# EAGLE design MAPE-CUN-Large-032 (EAGLE 7.3.0)
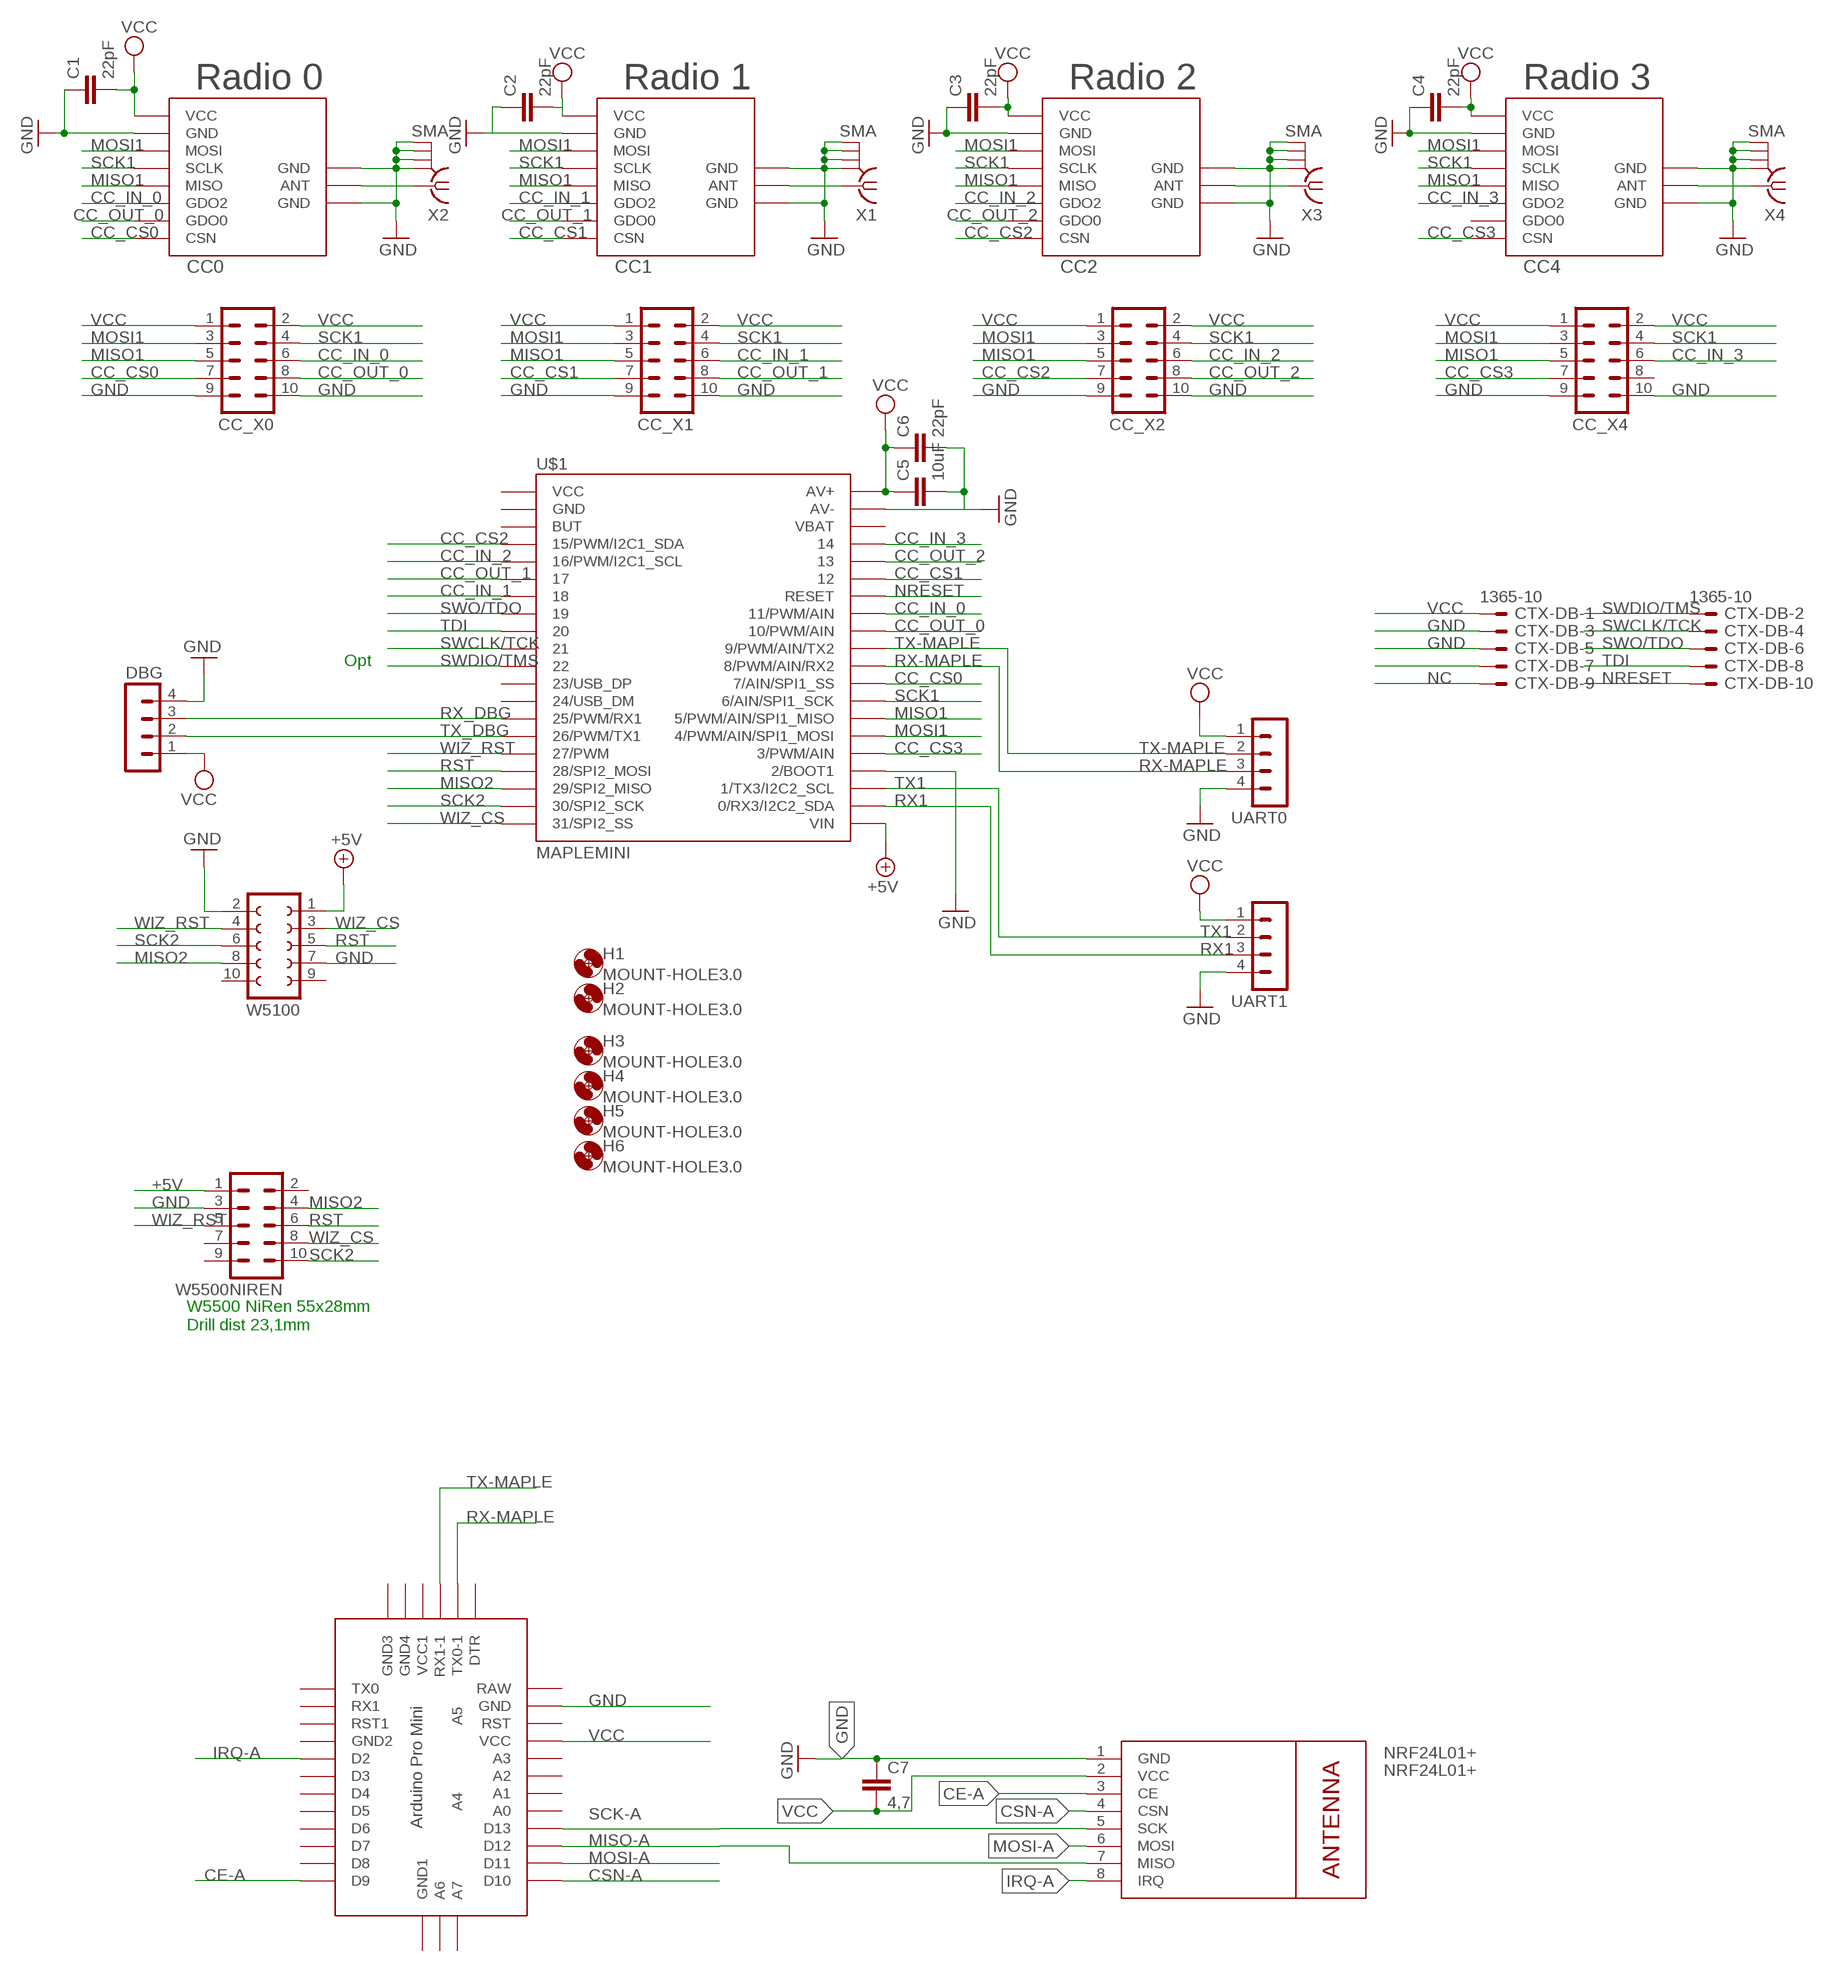
[diagram p0: schematic, sheet 1]

## Parts
C1  22pF  C-EUC0805  [C0805]
C2  22pF  C-EUC0805  [C0805]
C3  22pF  C-EUC0805  [C0805]
C4  22pF  C-EUC0805  [C0805]
C5  10uF  C-EUC1210  [C1210]
C6  22pF  C-EUC0805  [C0805]
C7  4,7  C-EUC1210  [C1210]
CC0  CC1101_MODULE1SMD  [CC1101_MODULE1_SMD]
CC1  CC1101_MODULE1SMD  [CC1101_MODULE1_SMD]
CC2  CC1101_MODULE1SMD  [CC1101_MODULE1_SMD]
CC4  CC1101_MODULE1SMD  [CC1101_MODULE1_SMD]
CC_X0  MA05-2  [MA05-2]
CC_X1  MA05-2  [MA05-2]
CC_X2  MA05-2  [MA05-2]
CC_X4  MA05-2  [MA05-2]
CTX-DB  1365-10  [1365-10]
DBG  MA04-1  [MA04-1]
H1  MOUNT-HOLE3.0  [3,0]
H2  MOUNT-HOLE3.0  [3,0]
H3  MOUNT-HOLE3.0  [3,0]
H4  MOUNT-HOLE3.0  [3,0]
H5  MOUNT-HOLE3.0  [3,0]
H6  MOUNT-HOLE3.0  [3,0]
NRF24L01+  NRF24L01+  WIRELESS-NRF24L01  [WIRELESS-NRF24L01]
U$1  MAPLEMINI  [20-DIP]
U$2  ABK-PRO-MINI  [ABK-PRO-MINI]
UART0  MA04-1  [MA04-1]
UART1  MA04-1  [MA04-1]
W5100  FE05-2  [FE05-2]
W5500NIREN  MA05-2  [MA05-2]
X1  SMA  [SMA]
X2  SMA  [SMA]
X3  SMA  [SMA]
X4  SMA  [SMA]

## Nets
+5V: U$1.21(VIN) W5100.1 W5500NIREN.1
CC_CS0: CC0.CSN CC_X0.7 U$1.29(7/AIN/SPI1_SS)
CC_CS1: CC1.CSN CC_X1.7 U$1.35
CC_CS2: CC2.CSN CC_X2.7 U$1.4(15/PWM/I2C1_SDA)
CC_CS3: CC4.CSN CC_X4.7 U$1.25(3/PWM/AIN)
CC_IN_0: CC0.GDO2 CC_X0.6 U$1.33(11/PWM/AIN)
CC_IN_1: CC1.GDO2 CC_X1.6 U$1.7
CC_IN_2: CC2.GDO2 CC_X2.6 U$1.5(16/PWM/I2C1_SCL)
CC_IN_3: CC4.GDO2 CC_X4.6 U$1.37
CC_OUT_0: CC0.GDO0 CC_X0.8 U$1.32(10/PWM/AIN)
CC_OUT_1: CC1.GDO0 CC_X1.8 U$1.6
CC_OUT_2: CC2.GDO0 CC_X2.8 U$1.36
CE-A: NRF24L01+.3(CE) U$2.D9
CSN-A: NRF24L01+.4(CSN) U$2.D10
GND: C1.1 C2.1 C3.1 C4.1 C5.2 C6.2 C7.1 CC0.GND@0(GND) CC0.GND@1(GND) CC0.GND@2(GND) CC1.GND@0(GND) CC1.GND@1(GND) CC1.GND@2(GND) CC2.GND@0(GND) CC2.GND@1(GND) CC2.GND@2(GND) CC4.GND@0(GND) CC4.GND@1(GND) CC4.GND@2(GND) CC_X0.9 CC_X0.10 CC_X1.9 CC_X1.10 CC_X2.9 CC_X2.10 CC_X4.9 CC_X4.10 CTX-DB.3 CTX-DB.5 DBG.4 NRF24L01+.1(GND) U$1.24(2/BOOT1) U$1.39(AV-) U$2.GND UART0.4 UART1.4 W5100.2 W5100.7 W5500NIREN.3 X1.GND@1 X1.GND@2 X1.GND@3 X1.GND@4 X2.GND@1 X2.GND@2 X2.GND@3 X2.GND@4 X3.GND@1 X3.GND@2 X3.GND@3 X3.GND@4 X4.GND@1 X4.GND@2 X4.GND@3 X4.GND@4
IRQ-A: NRF24L01+.8(IRQ) U$2.D2
MISO1: CC0.MISO CC1.MISO CC2.MISO CC4.MISO CC_X0.5 CC_X1.5 CC_X2.5 CC_X4.5 U$1.27(5/PWM/AIN/SPI1_MISO)
MISO2: U$1.18(29/SPI2_MISO) W5100.8 W5500NIREN.4
MISO-A: NRF24L01+.7(MISO) U$2.D12
MOSI1: CC0.MOSI CC1.MOSI CC2.MOSI CC4.MOSI CC_X0.3 CC_X1.3 CC_X2.3 CC_X4.3 U$1.26(4/PWM/AIN/SPI1_MOSI)
MOSI-A: NRF24L01+.6(MOSI) U$2.D11
N$1: CC2.ANT X3.1
N$2: CC4.ANT X4.1
N$3: CC1.ANT X1.1
N$4: CC0.ANT X2.1
N$8: CTX-DB.7
NC: CTX-DB.9
NRESET: CTX-DB.10 U$1.34(RESET)
RST: U$1.17(28/SPI2_MOSI) W5100.5 W5500NIREN.6
RX1: U$1.22(0/RX3/I2C2_SDA) UART1.3
RX-MAPLE: U$1.30(8/PWM/AIN/RX2) U$2.TX0-1 UART0.3
RX_DBG: DBG.3 U$1.14(25/PWM/RX1)
SCK1: CC0.SCLK CC1.SCLK CC2.SCLK CC4.SCLK CC_X0.4 CC_X1.4 CC_X2.4 CC_X4.4 U$1.28(6/AIN/SPI1_SCK)
SCK2: U$1.19(30/SPI2_SCK) W5100.6 W5500NIREN.10
SCK-A: NRF24L01+.5(SCK) U$2.D13
SWCLK/TCK: CTX-DB.4 U$1.10
SWDIO/TMS: CTX-DB.2 U$1.11
SWO/TDO: CTX-DB.6 U$1.8
TDI: CTX-DB.8 U$1.9
TX1: U$1.23(1/TX3/I2C2_SCL) UART1.2
TX-MAPLE: U$1.31(9/PWM/AIN/TX2) U$2.RX1-1 UART0.2
TX_DBG: DBG.2 U$1.15(26/PWM/TX1)
VCC: C1.2 C2.2 C3.2 C4.2 C5.1 C6.1 C7.2 CC0.VCC CC1.VCC CC2.VCC CC4.VCC CC_X0.1 CC_X0.2 CC_X1.1 CC_X1.2 CC_X2.1 CC_X2.2 CC_X4.1 CC_X4.2 CTX-DB.1 DBG.1 NRF24L01+.2(VCC) U$1.40(AV+) U$2.VCC UART0.1 UART1.1
WIZ_CS: U$1.20(31/SPI2_SS) W5100.3 W5500NIREN.8
WIZ_RST: U$1.16(27/PWM) W5100.4 W5500NIREN.5
Unconnected: CC4.GDO0 CC_X4.8 U$1.1(VCC) U$1.2(GND) U$1.3(BUT) U$1.12(23/USB_DP) U$1.13(24/USB_DM) U$1.38(VBAT) U$2.A0 U$2.A1 U$2.A2 U$2.A3 U$2.A4 U$2.A5 U$2.A6 U$2.A7 U$2.D3 U$2.D4 U$2.D5 U$2.D6 U$2.D7 U$2.D8 U$2.DTR U$2.GND1(GND2) U$2.GND2(GND3) U$2.GND3(GND4) U$2.GND4(GND1) U$2.RAW U$2.RST U$2.RST1 U$2.RX1 U$2.TX0 U$2.VCC1 W5100.9 W5100.10 W5500NIREN.2 W5500NIREN.7 W5500NIREN.9

## Notes on the sheet
- Radio 0 | Radio 1 | Radio 2 | Radio 3
- Opt
- W5500 NiRen 55x28mm
  Drill dist 23,1mm

## Library data of the parts
C1-C7 = rcl:C-EU: CAPACITOR, European symbol
CC0 CC1 CC2 CC4 = wireless:CC1101_MODULE1: CC1101 wireless module for 433/868 MHz (sold from Aliexpress). DIL version for mounting with pin header (and SMD soldering) and SMD only variant available.
CC_X0 CC_X1 CC_X2 CC_X4 W5500NIREN = con-lstb:MA05-2: PIN HEADER; OC_FARNELL: unknown; OC_NEWARK: unknown
CTX-DB = con-leotronics:1365-10: DUAL ROW STRAIGHT HEADER 1364 SERIES. 1.27mm x 1.27mm. Without Fixing Post. SMT Source: http://www.leotronics.co.uk/Conexcon/Data%20Sheets/sec.%20A/1364ing.pdf; OC_FARNELL: unknown; OC_NEWARK: unknown
DBG UART0 UART1 = con-lstb:MA04-1: PIN HEADER; OC_FARNELL: unknown; OC_NEWARK: unknown
H1-H6 = holes:MOUNT-HOLE: MOUNTING HOLE with drill center marker
NRF24L01+ = diy-modules:WIRELESS-NRF24L01: 2.4 GHz Wireless Module based on NRF24L01 chip
U$1 = maplemini-small:MAPLEMINI
U$2 = Arduino-clone:ABK-PRO-MINI: ABK Pro-Mini Arduino Clone
W5100 = con-lsta:FE05-2: FEMALE HEADER; OC_FARNELL: unknown; OC_NEWARK: unknown
X1-X4 = sma:SMA: SMA 50 Ohm end launch jack receptacle - round contact

## Net classes
0 default: width 0.406 mm
1 PWR: width 0.305 mm

## Board
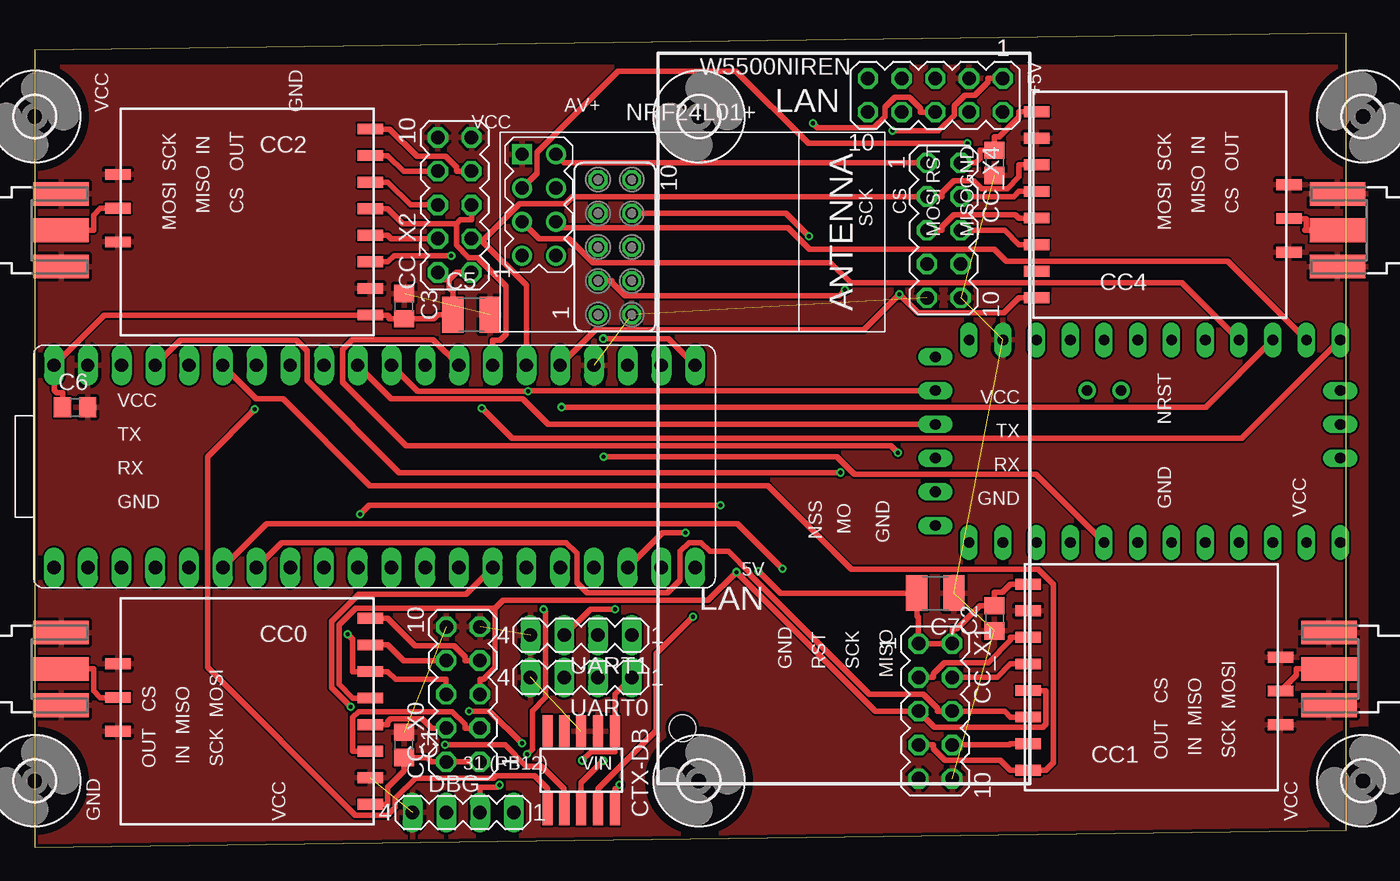
[diagram p1: board, top side]
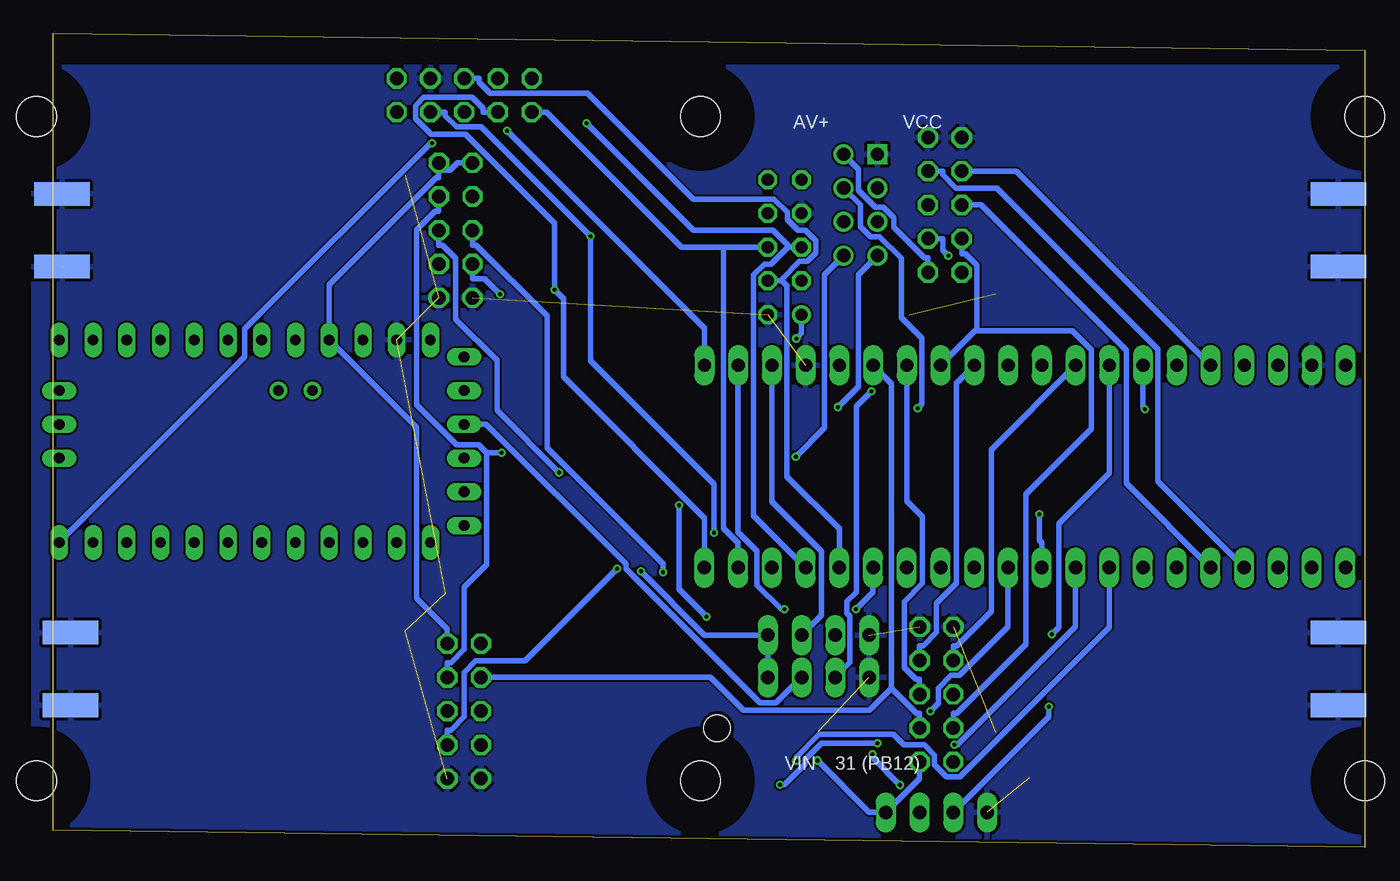
[diagram p2: board, bottom side, seen from below]

Size 98.73 x 61.27 mm. Coordinates in mm from the lower left corner, seen from the top.
Outline: 0,60 0,0 98.73,1.27 98.73,61.27 0,60
Copper layers (1*16): Top 0.035mm / dielectric 1.5mm / Bottom 0.035mm
Design rules "SeeedStudio_2layer_DRU_no_angle_20140221": minimum track width 6mil, minimum drill 12mil, track to track 6mil, track to pad 6mil, pad to pad 6mil, via to via 6mil, smd to smd 0mil, copper to edge 10mil, drill to drill 10mil, minimum pad ring 10mil, minimum via ring 6mil, stop-mask expansion 2mil, vias tented up to drill 100mil, thermal gap 10mil
Holes 2 mm at 48.76,8.97
tRestrict: area -0.1,59.1 to 100.2,59.8
bRestrict: area -0.1,59.1 to 100.2,59.8

### Footprints (pad centres in the part's own frame; a part is rotated, then mirrored left to right if it is on the bottom)
C0805 = smd 1.3 x 1.5: 1 -0.95,0; 2 0.95,0
C1210 = smd 1.6 x 2.7: 1 -1.4,0; 2 1.4,0
CC1101_MODULE1_SMD = smd 1.93 x 0.813: ANT 19,5.96; CSN 0,0; GDO0 0,2; GDO2 0,4; GND@0 0,12; GND@1 19,8.5; GND@2 19,3.42; MISO 0,6; MOSI 0,10; SCLK 0,8; VCC 0,14
MA05-2 = drill 1.016 octagon: 1 -5.08,-1.27; 2 -5.08,1.27; 3 -2.54,-1.27; 4 -2.54,1.27; 5 0,-1.27; 6 0,1.27; 7 2.54,-1.27; 8 2.54,1.27; 9 5.08,-1.27; 10 5.08,1.27
1365-10 = smd 0.76 x 2.4: 1 -2.54,-2.95; 2 -2.54,2.95; 3 -1.27,-2.95; 4 -1.27,2.95; 5 0,-2.95; 6 0,2.95; 7 1.27,-2.95; 8 1.27,2.95; 9 2.54,-2.95; 10 2.54,2.95
MA04-1 = drill 1.016 long: 1 -3.81,0; 2 -1.27,0; 3 1.27,0; 4 3.81,0
3,0 = hole 3: 0,0
WIRELESS-NRF24L01 = drill 1 square: 1 -12.7,6.35 | drill 1: 2 -10.16,6.35; 3 -12.7,3.81; 4 -10.16,3.81; 5 -12.7,1.27; 6 -10.16,1.27; 7 -12.7,-1.27; 8 -10.16,-1.27
20-DIP = drill 1.016 pad 1.27 long: 1 -24.13,-7.62; 2 -21.59,-7.62; 3 -19.05,-7.62; 4 -16.51,-7.62; 5 -13.97,-7.62; 6 -11.43,-7.62; 7 -8.89,-7.62; 8 -6.35,-7.62; 9 -3.81,-7.62; 10 -1.27,-7.62; 11 1.27,-7.62; 12 3.81,-7.62; 13 6.35,-7.62; 14 8.89,-7.62; 15 11.43,-7.62; 16 13.97,-7.62; 17 16.51,-7.62; 18 19.05,-7.62; 19 21.59,-7.62; 20 24.13,-7.62 | drill 1 pad 1.27 long: 21 24.13,7.62; 22 21.59,7.62; 23 19.05,7.62; 24 16.51,7.62; 25 13.97,7.62; 26 11.43,7.62; 27 8.89,7.62; 28 6.35,7.62; 29 3.81,7.62; 30 1.27,7.62; 31 -1.27,7.62; 32 -3.81,7.62; 33 -6.35,7.62; 34 -8.89,7.62; 35 -11.43,7.62; 36 -13.97,7.62; 37 -16.51,7.62; 38 -19.05,7.62; 39 -21.59,7.62; 40 -24.13,7.62
ABK-PRO-MINI = drill 0.8 long: A0 10.16,-3.81; A1 10.16,-6.35; A2 10.16,-8.89; A3 10.16,-11.43; A6 3.81,-21.59; A7 6.35,-21.59; D2 -5.08,-3.81; D3 -5.08,-6.35; D4 -5.08,-8.89; D5 -5.08,-11.43; D6 -5.08,-13.97; D7 -5.08,-16.51; D8 -5.08,-19.05; D9 -5.08,-21.59; D10 10.16,-21.59; D11 10.16,-19.05; D12 10.16,-16.51; D13 10.16,-13.97; DTR 8.89,8.89; GND 10.16,3.81; GND1 -5.08,-1.27; GND2 -3.81,8.89; GND3 -1.27,8.89; GND4 1.27,-21.59; RAW 10.16,6.35; RST 10.16,1.27; RST1 -5.08,1.27; RX1 -5.08,3.81; RX1-1 3.81,8.89; TX0 -5.08,6.35; TX0-1 6.35,8.89; VCC 10.16,-1.27; VCC1 1.27,8.89 | drill 0.8: A4 6.35,-5.08; A5 6.35,-2.54
FE05-2 = drill 0.914: 1 -5.08,1.27 | drill 0.914 octagon: 2 -5.08,-1.27; 3 -2.54,1.27; 4 -2.54,-1.27; 5 0,1.27; 6 0,-1.27; 7 2.54,1.27; 8 2.54,-1.27; 9 5.08,1.27; 10 5.08,-1.27
SMA = smd 4.191 x 1.778: 1 2.115,0; GND@1 2.115,2.733; GND@2 2.115,-2.733 | smd 4.191 x 1.778 bottom: GND@3 2.115,2.733; GND@4 2.115,-2.733

### Placement (x,y rotation side)
C1  27.8,7.71 270 top
C2  72.25,17.23 90 top
C3  27.8,40.73 270 top
C4  72.25,51.52 90 top
C5  32.88,40.09 0 top
C6  3.03,33.11 0 top
C7  67.8,19.13 180 top
CC0  25.26,17.23 180 top
CC1  74.79,5.8 0 top
CC2  25.26,54.06 180 top
CC4  75.42,41.36 0 top
CC_X0  32.24,11.51 90 top
CC_X1  67.8,10.24 270 top
CC_X2  31.61,48.35 90 top
CC_X4  68.44,46.44 270 top
CTX-DB  41.13,5.8 180 top
DBG  32.24,2.62 180 top
H1  100,5 0 top
H2  100,55 90 top
H3  0,5 0 top
H4  0,55 0 top
H5  50,5 0 top
H6  50,55 0 top
NRF24L01+  49.39,45.8 0 top
U$1  25.58,28.66 0 top
U$2  76.69,28.02 90 top
UART0  41.13,12.79 180 top
UART1  41.13,15.96 180 top
W5100  43.67,45.17 90 top
W5500NIREN  67.8,56.6 180 top
X1  99.55,13.42 180 top
X2  -0.14,13.42 0 top
X3  -0.14,46.44 0 top
X4  100.19,46.44 180 top

### Tracks (layer width: path | path; a pad name or v marks a point on that pad's centre or on a via)
+5V  (via drill 0.3 pad 0.61)
  Top 0.406: U$1.21 47.7,38.29 v42.8,38.29 | W5500NIREN.1 71.77,57.87 71.77,57.6 70.77,56.6 70.02,56.6 69.23,55.8 69.23,55.1 68.05,53.92 v64.58,53.92
  Bottom 0.406: v42.8,38.29 42.41,38.69 W5100.1 | U$1.21 49.71,39.05 v64.58,53.92
CC_CS0
  Top 0.406: CC0.CSN 26.58,17.23 28.64,15.17 31.56,15.17 32.4,14.33 32.4,14.05 CC_X0.7
  Bottom 0.406: CC_X0.7 33.52,15.17 33.24,15.17 32.24,16.17 32.24,18.37 30.76,19.86 30.76,34.91 U$1.29
CC_CS1
  Top 0.406: U$1.35 16.68,33.75 18.69,33.75 25.21,27.22 55.2,27.22 61.5,20.92 75.54,20.92 76.68,19.79 76.68,6.37 76.11,5.8 CC1.CSN 73.47,5.8 72.71,6.56 68.52,6.56 67.65,7.43 67.65,7.71 CC_X1.7
CC_CS2
  Top 0.406: CC_X2.7 31.76,50.89 31.76,51.17 30.92,52 28.79,52 26.73,54.06 CC2.CSN
  Bottom 0.406: U$1.4 15.58,27.55 15.58,37.5 27.7,49.62 30.77,49.62 31.76,50.61 31.76,50.89 CC_X2.7
CC_CS3  (via drill 0.3 pad 0.61)
  Top 0.406: U$1.25 42.22,38.95 62.42,38.95 v65.09,41.62 66.47,40.23 72.98,40.23 74.1,41.36 CC4.CSN
  Bottom 0.406: CC_X4.7 67.17,42.78 66.25,42.78 v65.09,41.62
CC_IN_0  (via drill 0.3 pad 0.61)
  Top 0.406: v23.57,16.05 23.94,15.67 23.94,13.23 CC0.GDO2 25.92,13.23 26.58,13.23 27.18,12.63 30.97,12.63 CC_X0.6
  Bottom 0.406: U$1.33 19.23,28.15 23.04,24.34 23.04,16.57 v23.57,16.05
CC_IN_1
  Top 0.406: 50.83,22.27 52.21,22.27 53.84,20.63 53.84,20.5 62.82,11.51 66.89,11.51 67.96,10.45 67.96,10.24 68.52,10.24 CC_X1.6 73.02,10.24 73.47,9.8 CC1.GDO2 | 50.83,22.27 | 50.83,22.27 50.17,22.92 49.24,22.92 48.59,22.27 48.59,20.11 47.62,19.14 41.58,19.14 40.82,19.9 40.82,22.12 40.01,22.93 18.57,22.93 U$1.7
CC_IN_2
  Top 0.406: CC2.GDO2 26.58,50.06 28.3,48.35 CC_X2.6
  Bottom 0.406: U$1.5 17.96,27.39 17.96,37.42 28.88,48.35 CC_X2.6
CC_IN_3  (via drill 0.3 pad 0.61)
  Top 0.406: U$1.37 10.94,38.15 19.73,38.15 20.5,37.38 20.5,35.14 27.43,28.21 v60.64,28.21 | CC4.GDO2 74.1,45.36 73.02,46.44 CC_X4.6
  Bottom 0.406: CC_X4.6 69.71,45.32 69.44,45.32 68.44,44.33 68.44,39.76 65.33,36.65 65.33,32.9 v60.64,28.21
CC_OUT_0
  Top 0.406: CC0.GDO0 26.58,15.23 27.76,14.05 CC_X0.8
  Bottom 0.406: U$1.32 28.12,29.93 28.12,17.76 30.7,15.17 30.97,15.17 CC_X0.8
CC_OUT_1  (via drill 0.3 pad 0.61)
  Top 0.406: U$1.6 17.44,24.34 52.91,24.34 v56.29,20.96 | CC1.GDO0 73.47,7.8 73.37,7.71 CC_X1.8
  Bottom 0.406: CC_X1.8 69.08,8.82 68.8,8.82 67.8,9.82 67.8,13.15 66.93,14.03 63.22,14.03 v56.29,20.96
CC_OUT_2
  Top 0.406: CC2.GDO0 26.58,52.06 27.76,50.89 CC_X2.8
  Bottom 0.406: U$1.36 26.21,50.89 CC_X2.8
CE-A  (via drill 0.3 pad 0.61)
  Top 0.406: v70.22,52.99 58.23,52.99 52.81,58.42 43.91,58.42 37.8,52.31 37.8,50.73 NRF24L01+.3
  Bottom 0.406: U$2.D9 84.31,36.92 84.31,39.02 70.34,52.99 v70.22,52.99
CSN-A  (via drill 0.3 pad 0.61)
  Top 0.406: U$2.D10 90.89,30.79 35.93,30.79 v33.66,33.06
  Bottom 0.406: NRF24L01+.4 37.96,48.35 37.96,46.72 37.2,45.97 36.53,45.97 34.89,44.33 34.89,39.84 33.35,38.3 33.35,33.37 v33.66,33.06
GND  (13 unrouted)
  pour Bottom: -0.14,59.78 -0.14,0.08 100.19,0.08 100.19,59.78
  pour Top: -0.14,0.08 -0.14,59.78 100.19,59.78 100.19,0.08
IRQ-A  (via drill 0.3 pad 0.61)
  Top 0.406: U$2.D2 75.38,28.07 61.71,28.07 60.39,29.39 v42.84,29.39
  Bottom 0.406: v42.84,29.39 40.66,31.57 40.66,43.11 NRF24L01+.8
MISO1  (via drill 0.3 pad 0.61)
  Top 0.406: 31.74,46.94 27.71,46.94 26.58,48.06 CC2.MISO | 31.74,46.94 32.03,47.23 32.88,47.23 CC_X2.5 | 31.74,46.94 31.74,45.3 32.66,44.38 33.34,44.38 35.48,42.24 35.48,38.61 35.02,38.14 34.47,38.14 U$1.27 | 34.66,17.99 35.24,18.58 50.69,18.58 v52.82,20.72 63.29,10.24 CC_X1.5 67.75,9.03 75.9,9.03 76.11,9.24 76.11,11.8 CC1.MISO | 34.66,17.99 24.15,17.99 22.91,16.75 22.91,12.26 23.94,11.23 CC0.MISO | 34.66,17.99 34.66,13.5 33.79,12.63 33.52,12.63 CC_X0.5 | CC4.MISO 74.1,47.36 73.84,47.62 69.19,47.62 68.29,46.72 68.29,46.44 CC_X4.5
  Bottom 0.406: CC_X0.5 33.52,12.63 33.79,12.63 34.67,13.51 34.67,18.48 33.3,19.86 33.3,24.87 34.47,26.04 U$1.27 | v52.82,20.72 52.82,21.33 61.56,30.06 61.56,39.99 66.89,45.32 67.17,45.32 CC_X4.5
MISO2  (via drill 0.3 pad 0.61)
  Top 0.406: W5100.8 46.01,47.71 56.56,47.71 v58.28,45.99 | v49,23.68 47.26,23.68 U$1.18
  Bottom 0.406: W5500NIREN.4 69.23,55.33 69.23,55.05 68.39,54.21 66.51,54.21 v58.28,45.99 58.28,36.62 49,27.34 v49,23.68
MISO-A  (via drill 0.3 pad 0.61)
  Top 0.406: U$2.D12 88.16,33.14 v39.66,33.14
  Bottom 0.406: v39.66,33.14 38.12,34.68 38.12,43.11 NRF24L01+.7
MOSI1  (via drill 0.3 pad 0.61)
  Top 0.406: CC2.MOSI 26.58,44.06 27.05,44.53 v31.36,44.53 | 33.67,45.62 36.5,48.45 39.95,48.45 40.48,48.98 66.05,48.98 CC_X4.3 68.29,48.98 68.29,49.25 69.2,50.17 70.67,50.17 71.28,49.56 73.22,49.56 74.1,50.45 74.1,51.36 CC4.MOSI | 33.67,45.62 33.49,45.8 CC_X2.3 | U$1.26 37.01,42.29 33.67,45.62 | CC0.MOSI 23.94,7.23 23.94,9.79 24.36,10.22 31.43,10.22 32.4,9.25 32.4,8.97 CC_X0.3 | CC1.MOSI 73.47,15.8 73.47,15.59 71.79,13.9 68.49,13.9 67.65,13.06 67.65,12.79 CC_X1.3
  Bottom 0.406: CC_X2.3 31.76,45.8 31.76,44.93 v31.36,44.53 | 35.62,11.97 33.74,10.09 33.52,10.09 CC_X0.3 | U$1.26 35.62,34.89 35.62,11.97 | 35.62,11.97 37.28,10.31 46.76,10.31 49.24,12.79 65.42,12.79 CC_X1.3
MOSI-A
  Top 0.406: NRF24L01+.6 39.69,46.62 56.72,46.62 58.32,45.02 72.24,45.02 73.13,44.12 89.81,44.12 U$2.D11
N$1
  Top 0.406: X3.1 4.43,46.44 4.43,47.59 4.94,48.1 CC2.ANT
N$2
  Top 0.406: CC4.ANT 95.75,47.32 95.75,46.56 95.62,46.44 X4.1
N$3
  Top 0.406: X1.1 94.99,13.42 94.99,12.96 CC1.ANT
N$4
  Top 0.406: CC0.ANT 4.94,11.27 4.43,11.78 4.43,13.42 X2.1
NRESET  (via drill 0.3 pad 0.61)
  Top 0.406: CTX-DB.10 38.59,4.41 37.62,5.38 34.73,5.38 34.55,5.2 28.65,5.2 27.14,3.69 27.14,3 26.56,2.42 24.13,2.42 13,13.54 13,29.4 v16.56,32.96
  Bottom 0.406: U$1.34 16.69,33.08 v16.56,32.96
RST  (via drill 0.3 pad 0.61)
  Top 0.406: W5500NIREN.6 66.69,55.33 66.69,55.61 65.85,56.45 64.76,56.45 64,55.69 64,55 63.15,54.15 58.93,54.15 v58.6,54.48
  Bottom 0.406: 43.29,45.17 43.42,45.17 44.69,43.9 45.19,43.9 46.01,43.07 46.01,24.96 U$1.17 | W5100.5 43.29,45.17 | v58.6,54.48 50.55,46.44 44.56,46.44 43.29,45.17
RX1  (via drill 0.3 pad 0.61)
  Top 0.406: UART1.3 41.83,17.92 v43.67,17.92
  Bottom 0.406: v43.67,17.92 43.92,17.92 45.74,19.74 45.74,22.29 47.17,23.71 U$1.22
RX-MAPLE  (via drill 0.3 pad 0.61)
  Top 0.406: U$1.30 28.82,34.31 v37.14,34.31 37.21,34.38 66.14,34.38 U$2.TX0-1
  Bottom 0.406: UART0.3 38.74,13.91 38.74,17.4 38.96,17.63 38.96,18.51 38.28,19.2 38.28,33.18 v37.14,34.31
RX_DBG  (via drill 0.3 pad 0.61)
  Top 0.406: U$1.14 32.48,19.05 24.38,19.05 22.35,17.02 22.35,12 v23.78,10.57
  Bottom 0.406: v23.78,10.57 23.78,9.82 DBG.3
SCK1  (via drill 0.3 pad 0.61)
  Top 0.406: v64.99,29.7 64.46,30.23 27.96,30.23 23.19,35 23.19,37.5 23.91,38.21 30,38.21 U$1.28 | CC_X4.4 73.72,48.98 74.1,49.36 CC4.SCLK | CC_X2.4 26.84,45.8 26.58,46.06 CC2.SCLK | CC0.SCLK 26.58,9.23 26.58,9.44 26.8,9.66 29.17,9.66 29.86,8.97 CC_X0.4 | CC1.SCLK 73.47,13.8 72.45,12.79 CC_X1.4
  Bottom 0.406: U$1.28 29.35,38.86 29.19,38.86 | 66.11,29.7 66.11,21.27 67.8,19.57 67.8,14.9 68.8,13.9 69.08,13.9 CC_X1.4 | 66.11,29.7 66.71,30.3 68.38,30.3 71.39,33.31 71.39,46.47 69.99,47.86 69.71,47.86 CC_X4.4 | v64.99,29.7 66.11,29.7 | 29.19,38.86 22.02,38.86 20.59,37.44 20.59,31.51 25.52,26.58 25.52,15.27 30.7,10.09 30.97,10.09 CC_X0.4 | 29.19,38.86 29.19,43.81 30.07,44.69 30.34,44.69 CC_X2.4
SCK2
  Bottom 0.406: W5500NIREN.10 61.61,55.33 51.45,45.17 48.28,45.17 | U$1.19 47.17,22.92 48.28,24.03 48.28,45.17 | 48.28,45.17 W5100.6
SCK-A
  Top 0.406: U$2.D13 86.37,42.48 61.43,42.48 59.91,44 42.02,44 40.21,45.8 37.96,45.8 NRF24L01+.5
SWCLK/TCK  (via drill 0.3 pad 0.61)
  Top 0.406: CTX-DB.4 42.41,4.41 46.76,8.76 46.76,14.56 v49.55,17.36 | v24.49,25.07 25.16,25.74 v51.62,25.74
  Bottom 0.406: v49.55,17.36 51.62,19.43 v51.62,25.74 | U$1.10 24.31,22.92 24.49,23.11 v24.49,25.07
SWDIO/TMS  (via drill 0.3 pad 0.61)
  Top 0.406: CTX-DB.2 43.67,4.41 43.74,4.41 v44.03,4.7 | v32.69,10.25 34.25,10.25 v36.67,7.83
  Bottom 0.406: v36.67,7.83 40.9,7.83 42.14,6.59 42.14,6.25 43.7,4.7 v44.03,4.7 | v32.69,10.25 32.09,10.84 32.09,11.98 31.14,12.94 30.51,12.94 26.85,16.6 U$1.11
SWO/TDO  (via drill 0.3 pad 0.61)
  Top 0.406: v42.8,6.53 41.13,4.86 CTX-DB.6
  Bottom 0.406: U$1.8 19.23,16.57 30.48,5.32 31.49,5.32 32.4,6.22 32.4,6.94 33.16,7.71 34.67,7.71 35.46,8.49 41.08,8.49 42.8,6.78 v42.8,6.53
TDI  (via drill 0.3 pad 0.61)
  Top 0.406: CTX-DB.8 39.87,4.41 38.16,6.11 37,6.11 35.41,7.71 v30.88,7.71
  Bottom 0.406: U$1.9 21.77,16.6 30.66,7.71 v30.88,7.71
TX1
  Bottom 0.406: UART1.2 40.9,17.46 40.9,22.3 44.63,26.02 U$1.23
TX-MAPLE
  Top 0.406: U$2.RX1-1 38.64,31.83 36.73,33.75 26.84,33.75 U$1.31
  Bottom 0.406: UART0.2 44.32,10.87 45.53,10.87 55.63,20.97 55.63,21.32 66.14,31.83 U$2.RX1-1
TX_DBG  (via drill 0.3 pad 0.61)
  Top 0.406: DBG.2 33.52,4.5 34.8,4.5 v34.98,4.69 | v38.3,17.9 38.47,17.74 38.47,11.27 37.47,10.28 37.47,7.39 v37.08,6.99
  Bottom 0.406: U$1.15 37.01,19.16 37.05,19.16 v38.3,17.9 | v37.08,6.99 37.08,6.78 v34.98,4.69
VCC  (via drill 0.3 pad 0.61)
  Top 0.406: 31.2,42.71 31.76,43.27 CC_X2.1 | 31.2,42.71 30.34,42.71 CC_X2.2 | 31.2,42.71 31.2,42.07 31.48,41.8 C5.1 30.32,40.09 30.01,39.78 C3.2 26.69,39.78 26.69,39.95 26.58,40.06 CC2.VCC 5.23,40.06 U$1.40 1.45,35.97 1.45,34.42 1.65,34.21 2.08,34.21 C6.1 | CC_X4.1 39.87,51.52 NRF24L01+.2 | v41.22,6.54 41.88,7.19 43.67,7.19 CTX-DB.1 43.67,11.51 UART0.1 | v54.5,20.77 56.14,19.13 C7.2 66.41,17.43 66.53,17.3 CC_X1.1 CC_X1.2 69.08,16.44 69.41,16.44 71.14,18.18 C2.2 72.25,19.19 72.86,19.19 73.47,19.8 CC1.VCC | CC4.VCC 74.1,55.36 74.1,54.95 72.63,53.48 72.25,53.48 C4.2 71.14,52.47 71.14,51.84 70.83,51.52 CC_X4.2 | CC_X0.1 CC_X0.2 29.86,6.44 29.54,6.75 28.91,6.75 C1.2 27.8,5.75 26.58,4.53 26.58,3.23 CC0.VCC
  Bottom 0.406: v54.5,20.77 49.69,15.96 UART1.1 44.95,14.66 UART0.1 | CC_X2.1 32.88,44.38 33.15,44.38 35.43,46.66 35.43,47.39 36.23,48.19 36.85,48.19 38.12,49.46 38.12,51.05 NRF24L01+.2 | v41.22,6.54 37.31,2.62 DBG.1 33.52,5.17 CC_X0.1 | CC_X1.2 69.08,16.44 71.39,18.76 71.39,31.61 U$2.VCC 77.97,42.35 69.92,50.4 69.71,50.4 69.71,50.96 | CC_X4.1 68.29,51.52 68.85,50.96 69.71,50.96 | CC_X4.2 69.71,50.96
WIZ_CS  (via drill 0.3 pad 0.61)
  Top 0.406: W5100.3 43.47,42.63 43.47,42.5 44.45,41.52 60.57,41.52 v61.01,41.97
  Bottom 0.406: U$1.20 49.71,24.78 60.33,35.4 60.33,41.28 v61.01,41.97 61.01,46.96 67.7,53.65 70.28,53.65 71.47,54.85 71.47,55.83 70.85,56.45 67.22,56.45 66.38,55.61 66.38,55.33 W5500NIREN.8
WIZ_RST
  Bottom 0.406: 43.88,42.63 43.5,42.25 43.5,27.91 39.55,23.96 U$1.16 | 43.88,42.63 44.02,42.63 W5100.4 | W5500NIREN.5 66.69,57.87 66.69,57.59 65.85,56.75 58.5,56.75 50.52,48.78 44.47,48.78 43.47,47.78 43.47,47.23 42.68,46.44 42.12,46.44 41.33,45.65 41.33,44.73 41.97,44.1 42.54,44.1 43.88,42.76 43.88,42.63

### Text on the board
tNames: GND | +5V | VCC | GND | AV+ | LAN | VCC | IN | RST | GND | IN | SCK | OUT | SCK | OUT | SCK | CS | MOSI | MISO | MISO | CS | MISO | CS | MOSI | MOSI | VCC | VCC | TX | NRST | TX | RX | RX | NSS | GND | GND | GND | GND | VCC | MO | 5V | LAN | MOSI | MOSI | GND | RST | SCK | CS | MISO | MISO | CS | MISO | OUT | SCK | OUT | SCK | IN | IN | 31 (PB12) | VIN | GND | VCC | VCC
bNames: VCC | AV+ | 31 (PB12) | VIN